# EAGLE design BLE (EAGLE 6.1)
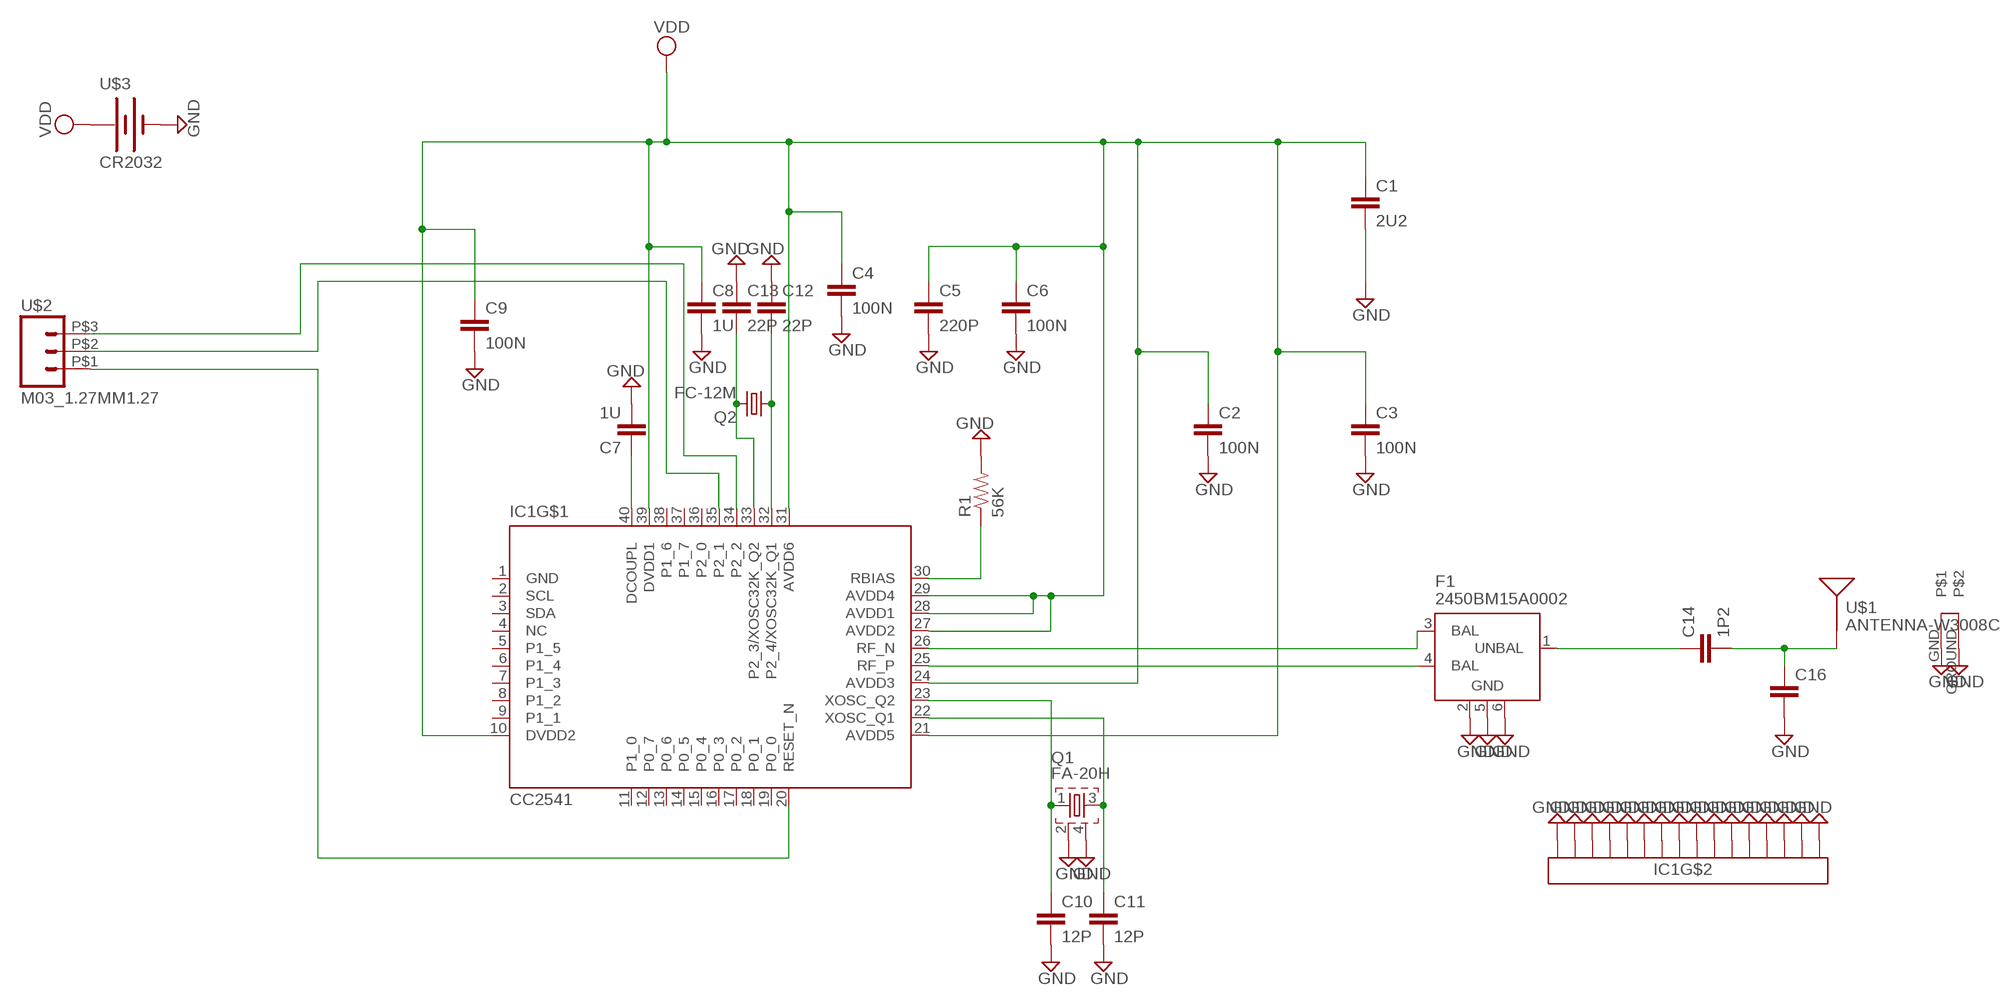
[diagram p0: schematic, sheet 1]

## Parts
C1  2U2  CAP0402-CAP  [0402-CAP]
C2  100N  CAP0402-CAP  [0402-CAP]
C3  100N  CAP0402-CAP  [0402-CAP]
C4  100N  CAP0402-CAP  [0402-CAP]
C5  220P  CAP0402-CAP  [0402-CAP]
C6  100N  CAP0402-CAP  [0402-CAP]
C7  1U  CAP0402-CAP  [0402-CAP]
C8  1U  CAP0402-CAP  [0402-CAP]
C9  100N  CAP0402-CAP  [0402-CAP]
C10  12P  CAP0402-CAP  [0402-CAP]
C11  12P  CAP0402-CAP  [0402-CAP]
C12  22P  CAP0402-CAP  [0402-CAP]
C13  22P  CAP0402-CAP  [0402-CAP]
C14  1P2  CAP0402-CAP  [0402-CAP]
C16  CAP0402-CAP  [0402-CAP]
F1  2450BM15A0002  [2450BM15A0002]
IC1  CC2541  [QFN40-6X6]
Q1  FA-20H  [FA-20H]
Q2  FC-12M  [FC-12M]
R1  56K  RESISTOR0402-RES  [0402-RES]
U$1  ANTENNA-W3008C  [ANTENNA-W3008C]
U$2  M03_1.27MM1.27  [1X3_1.27MM]
U$3  CR2032  [BATTCON_2032]

## Nets
GND: C1.2 C2.2 C3.2 C4.2 C5.2 C6.2 C7.2 C8.2 C9.2 C10.2 C11.2 C12.1 C13.1 C16.2 F1.2(GND) F1.5(GND) F1.6(GND) IC1.EXP@1(EXP16) IC1.EXP@2(EXP16) IC1.EXP@3(EXP16) IC1.EXP@4(EXP16) IC1.EXP@5(EXP16) IC1.EXP@6(EXP16) IC1.EXP@7(EXP16) IC1.EXP@8(EXP16) IC1.EXP@9(EXP16) IC1.EXP@10(EXP16) IC1.EXP@11(EXP16) IC1.EXP@12(EXP16) IC1.EXP@13(EXP16) IC1.EXP@14(EXP16) IC1.EXP@15(EXP16) IC1.EXP@16(EXP16) Q1.2 Q1.4 R1.2 U$1.GND U$1.GROUND U$3.PWR@2(-)
N$1: IC1.30(RBIAS) R1.1
N$2: C7.1 IC1.40(DCOUPL)
N$3: C11.1 IC1.22(XOSC_Q1) Q1.3
N$4: C10.1 IC1.23(XOSC_Q2) Q1.1
N$5: C12.2 IC1.32(P2_4/XOSC32K_Q1) Q2.1
N$6: C13.2 IC1.33(P2_3/XOSC32K_Q2) Q2.2
N$7: F1.3(BAL) IC1.26(RF_N)
N$8: F1.4(BAL) IC1.25(RF_P)
N$9: C14.1 F1.1(UNBAL)
N$10: C14.2 C16.1 U$1.FEED(SIGNAL)
N$11: IC1.20(RESET_N) U$2.P$1
N$13: IC1.34(P2_2) U$2.P$3
N$14: IC1.35(P2_1) U$2.P$2
VDD: C1.1 C2.1 C3.1 C4.1 C5.1 C6.1 C8.1 C9.1 IC1.10(DVDD2) IC1.21(AVDD5) IC1.24(AVDD3) IC1.27(AVDD2) IC1.28(AVDD1) IC1.29(AVDD4) IC1.31(AVDD6) IC1.39(DVDD1) U$3.PWR@1(+)
Unconnected: IC1.2(SCL) IC1.3(SDA) IC1.5(P1_5) IC1.6(P1_4) IC1.7(P1_3) IC1.8(P1_2) IC1.9(P1_1) IC1.11(P1_0) IC1.12(P0_7) IC1.13(P0_6) IC1.14(P0_5) IC1.15(P0_4) IC1.16(P0_3) IC1.17(P0_2) IC1.18(P0_1) IC1.19(P0_0) IC1.36(P2_0) IC1.37(P1_7) IC1.38(P1_6)

## Power pins joined to a net without a drawn wire
GND: IC1.1(GND)
NC: IC1.4(NC)

## Library data of the parts
C1-C14 C16 = SparkFun-Capacitors:CAP: Capacitor Standard 0603 ceramic capacitor, and 0.1" leaded capacitor.
F1 = johanson-technology:2450BM15A0002: 2.45 GHz Impedance Matched Balun-Filter For TI CC253X/CC2540 Chipset family Data sheet <http://www.johansontechnology.com/images/stories/ip/baluns/balun_filter_combo_matched_2450bm15a0002_v8.pdf>
IC1 = texas:CC2541: 2.4-GHz Bluetooth® low energy System-on-Chip Auto generated by make-symbol-device-package-bsdl.ulp Rev. 39 Source: cc2540.txt
Q1 = crystal:FA-: MHz RANGE CRYSTAL UNIT Source: Epson Toyocom
Q2 = crystal:FC-12M: kHz RANGE CRYSTAL UNIT LOW PROFILE SMD Source: Epson Toyocom FC-12M.pdf
R1 = SparkFun-Resistors:RESISTOR: Resistor Basic schematic elements and footprints for 0603, 1206, and PTH resistors.
U$1 = SparkFun-RF:ANTENNA-W3008C
U$2 = SparkFun-Connectors:M03_1.27MM
U$3 = SparkFun-Electromechanical:CR2032

## Board
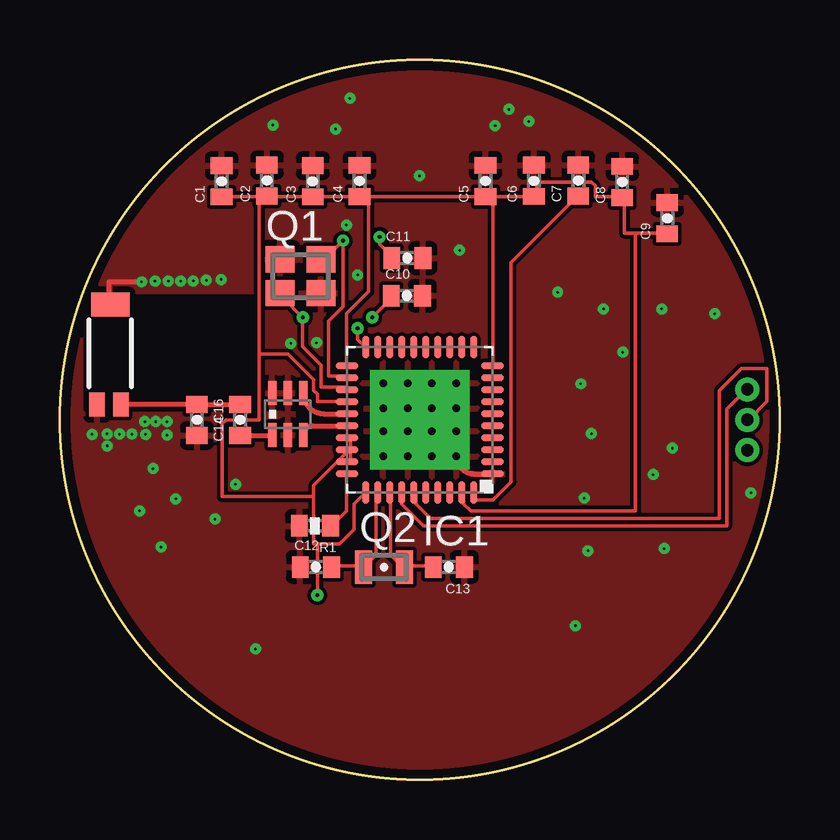
[diagram p1: board, top side]
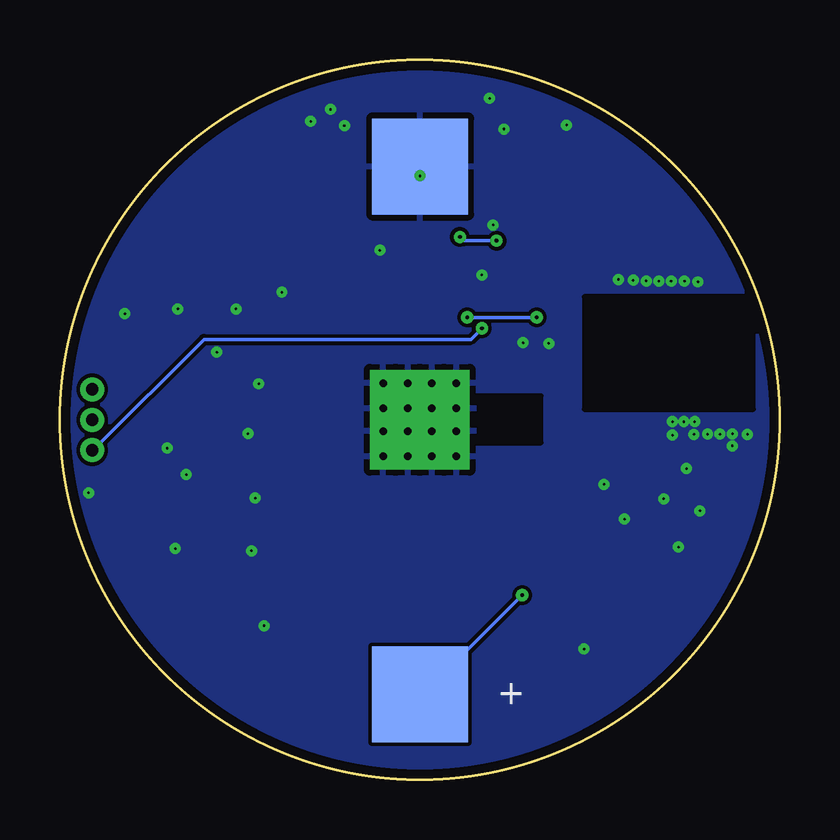
[diagram p2: board, bottom side, seen from below]

Size 30 x 30 mm. Coordinates in mm from the lower left corner, seen from the top.
Outline: circle at 15,15 radius 15
Copper layers (1*16): Top 0.0356mm / dielectric 1.5011mm / Bottom 0.0356mm
Design rules: minimum track width 6mil, minimum drill 13mil, track to track 6mil, track to pad 6mil, pad to pad 6mil, via to via 6mil, smd to smd 6mil, copper to edge 15mil, drill to drill 6mil, minimum pad ring 7mil, minimum via ring 7mil, stop-mask expansion 3mil, vias tented up to drill 0mil, thermal gap 10mil

### Footprints (pad centres in the part's own frame; a part is rotated, then mirrored left to right if it is on the bottom)
0402-CAP = smd 0.7 x 0.9: 1 -0.65,0; 2 0.65,0
2450BM15A0002 = smd 0.35 x 1: 1 -0.65,-0.875; 2 0,-0.875; 3 0.65,-0.875; 4 0.65,0.875; 5 0,0.875; 6 -0.65,0.875
QFN40-6X6 = smd 0.95 x 0.28: 1 -3.025,2.25; 2 -3.025,1.75; 3 -3.025,1.25; 4 -3.025,0.75; 5 -3.025,0.25; 6 -3.025,-0.25; 7 -3.025,-0.75; 8 -3.025,-1.25; 9 -3.025,-1.75; 10 -3.025,-2.25; 21 3.025,-2.25; 22 3.025,-1.75; 23 3.025,-1.25; 24 3.025,-0.75; 25 3.025,-0.25; 26 3.025,0.25; 27 3.025,0.75; 28 3.025,1.25; 29 3.025,1.75; 30 3.025,2.25 | smd 0.28 x 0.95: 11 -2.25,-3.025; 12 -1.75,-3.025; 13 -1.25,-3.025; 14 -0.75,-3.025; 15 -0.25,-3.025; 16 0.25,-3.025; 17 0.75,-3.025; 18 1.25,-3.025; 19 1.75,-3.025; 20 2.25,-3.025; 31 2.25,3.025; 32 1.75,3.025; 33 1.25,3.025; 34 0.75,3.025; 35 0.25,3.025; 36 -0.25,3.025; 37 -0.75,3.025; 38 -1.25,3.025; 39 -1.75,3.025; 40 -2.25,3.025 | drill 0.3 pad 1.1 square: EXP@1 -1.525,1.525; EXP@2 -0.5,1.525; EXP@3 0.5,1.525; EXP@4 1.525,1.525; EXP@5 -1.525,0.475; EXP@6 -0.5,0.475; EXP@7 0.5,0.475; EXP@8 1.525,0.475; EXP@9 -1.525,-0.475; EXP@10 -0.5,-0.475; EXP@11 0.5,-0.475; EXP@12 1.525,-0.475; EXP@13 -1.525,-1.525; EXP@14 -0.5,-1.525; EXP@15 0.5,-1.525; EXP@16 1.525,-1.525
FA-20H = smd 1.2 x 1.1: 1 -0.85,-0.7; 2 0.85,-0.7; 3 0.85,0.7; 4 -0.85,0.7
FC-12M = smd 0.7 x 1.4: 1 -0.85,0; 2 0.85,0
0402-RES = smd 0.7 x 0.9: 1 -0.65,0; 2 0.65,0
ANTENNA-W3008C = smd 0.65 x 1: FEED -0.45,2.52; GROUND 0.55,2.52 | smd 1.6 x 1: GND 0,-1.651
1X3_1.27MM = drill 0.508 pad 1: P$1 -1.27,0; P$2 0,0; P$3 1.27,0
BATTCON_2032 = smd 4 x 4: PWR@1 -11.46,0; PWR@2 10.54,0

### Placement (x,y rotation side)
C1  6.74,24.94 90 top
C2  8.63,24.97 90 top
C3  10.54,24.94 90 top
C4  12.49,24.95 90 top
C5  17.74,24.95 90 top
C6  19.76,24.96 90 top
C7  21.61,24.97 90 top
C8  23.44,24.91 90 top
C9  25.32,23.4 90 top
C10  14.46,20.17 0 top
C11  14.48,21.74 0 top
C12  10.67,8.86 0 top
C13  16.21,8.86 180 top
C14  7.51,14.99 90 top
C16  5.71,14.99 270 top
F1  9.5,15.23 0 top
IC1  15,15 180 top
Q1  10.03,20.98 0 top
Q2  13.51,8.86 0 top
R1  10.63,10.58 180 top
U$1  2.1,18.15 180 top
U$2  28.66,15 90 top
U$3  14.98,15.02 90 bottom

### Tracks (layer width: path | path; a pad name or v marks a point on that pad's centre or on a via)
GND  (via drill 0.1)
  Top 0.203: IC1.EXP@1 arc90 17.25,12.75 IC1.1 | IC1.1 18.19,12.75 IC1.1 | U$1.GND 2.05,19.8 2.05,20.75 v3.4,20.75
  other vias: 3.96,20.78 4.52,20.78 5.03,20.78 5.56,20.79 6.1,20.82 6.72,20.85 9.62,18.18 10.69,18.21 12.41,21.04 11.94,23.12 14.99,25.17 20.75,20.32 23.46,17.82 21.71,16.5 21.86,11.73 22.02,9.54 25.19,9.63 24.73,12.71 4.21,9.69 3.32,11.2 6.46,10.86 7.32,12.31 3.88,12.96 4.83,11.7 1.97,13.91 16.66,22.07 11.49,27.12 8.88,27.29 12.09,28.4 18.72,27.94 19.55,27.44 18.14,27.26 27.3,19.42 22.66,19.62 25.09,19.62 25.53,13.82 22.16,14.42 28.81,11.95 21.49,6.41 8.15,5.44 1.34,14.39 1.96,14.41 2.48,14.4 3,14.4 3.57,14.39 3.54,14.92 3.99,14.92 4.46,14.92 4.46,14.36
  pour Top: 0.27,15.02 arc-180 29.68,15 arc-180
  pour Bottom: 0.27,15.02 arc-180 29.68,15 arc-180
N$1
  Top 0.152: R1.1 11.34,10.58 11.95,11.19 11.95,12.71 IC1.30
N$2
  Top 0.152: C7.1 21.55,24.3 18.81,21.55 18.81,12.41 18.05,11.65 17.29,11.65 17.29,11.95 IC1.40
N$3  (via drill 0.15)
  Top 0.152: v13.32,22.62 13.32,22.32 13.78,21.86 C11.1 | Q1.3 10.88,21.55 v11.8,22.47 11.8,19.72 11.19,19.12 11.19,16.83 11.95,16.83 IC1.22
  Bottom 0.152: v13.32,22.62 13.17,22.47 v11.8,22.47
N$4  (via drill 0.15)
  Top 0.152: v13.02,19.27 13.78,20.03 C10.1 | Q1.1 9.21,20.18 v10.12,19.27 10.12,18.05 10.88,17.29 10.88,16.37 11.95,16.37 IC1.23
  Bottom 0.152: v10.12,19.27 v13.02,19.27
N$5
  Top 0.152: C12.2 11.34,8.9 12.56,8.9 Q2.1 12.71,8.9 13.17,9.36 13.17,11.95 IC1.32
N$6
  Top 0.152: C13.2 15.46,8.9 14.39,8.9 Q2.2 14.24,8.9 13.78,9.36 13.78,11.95 IC1.33
N$7
  Top 0.203: F1.3 arc-90 10.54,14.75 IC1.26
N$8
  Top 0.203: F1.4 arc90 11,15.25 IC1.25
N$9
  Top 0.203: C14.1 F1.1
N$10
  Top 0.203: C16.1 | C16.1 C14.2 | C16.1 | C16.1 U$1.FEED
N$11  (via drill 0.15)
  Top 0.152: v12.41,18.81 12.41,18.35 12.71,18.05 IC1.20
  Bottom 0.152: v12.41,18.81 12.87,18.35 23.99,18.35 28.56,13.78 U$2.P$1
N$12
  pour Top: 8.17,15.28 0.25,15.28 0.25,15.25
N$13
  Top 0.152: IC1.34 14.24,11.95 14.24,11.5 15.15,10.58 27.8,10.58 27.8,15.46 28.56,16.22 U$2.P$3
N$14
  Top 0.152: IC1.35 14.85,11.95 14.85,11.5 15.46,10.88 27.5,10.88 27.5,16.22 28.41,17.13 29.48,17.13 29.48,15.76 28.72,15 U$2.P$2
N$15
  cutout Bottom (isolate 1.27): 1.21,20.13 8.14,20.13 8.14,15.43 1.09,15.43 1.09,20.11 1.21,20.11
  cutout Top (isolate 1.27): 1.21,20.13 8.14,20.13 8.14,15.43 1.09,15.43 1.09,20.11 1.21,20.11
N$16
  cutout Top (isolate 1.27): 9.96,16 12.54,16 12.54,14.04 9.94,14.04 9.94,16
  cutout Bottom (isolate 1.27): 9.96,16 12.54,16 12.54,14.04 9.94,14.04 9.94,16
VDD  (via drill 0.15)
  Top 0.152: 23.99,22.77 23.53,22.77 23.53,24.14 C8.1 23.38,24.3 22.32,24.3 22.32,24.75 22.16,24.91 19.88,24.91 19.88,24.45 C6.1 19.72,24.3 18.05,24.3 | 23.99,22.77 25.21,22.77 C9.1 | 23.99,22.77 23.99,11.19 17.13,11.19 16.83,11.5 16.83,11.95 IC1.39 | 18.05,24.3 C5.1 | 18.05,24.3 18.05,17.29 IC1.10 | 18.05,24.3 C5.1 | IC1.29 12.1,13.32 12.1,13.63 IC1.28 | IC1.27 12.1,14.24 12.1,13.78 IC1.28 | 10.73,9.82 10.58,9.82 10.58,11.8 | 10.73,9.82 11.65,9.82 12.26,10.43 12.26,11.5 12.71,11.95 IC1.31 | 10.58,11.8 10.58,12.26 11.95,13.63 IC1.28 | 8.29,24.3 8.6,24.3 C2.1 | 8.29,24.3 6.77,24.3 C1.1 | C2.1 8.75,24.3 10.43,24.3 C3.1 10.58,24.3 12.41,24.3 C4.1 | 8.29,17.74 9.51,17.74 10.58,16.68 10.58,16.22 10.73,16.07 10.73,15.76 11.95,15.76 IC1.24 | 8.29,24.3 8.29,17.74 | 8.29,24.3 C2.1 | 12.56,24.3 12.87,23.99 12.87,20.33 11.95,19.42 11.95,17.29 IC1.21 | 12.56,24.3 C4.1 | 10.58,11.8 6.77,11.8 6.77,14.85 6.92,15 8.29,15 8.29,17.74 | 12.56,24.3 17.59,24.3 C5.1 | 12.56,24.3 C4.1 | 10.73,9.82 v10.73,7.68
  Bottom 0.152: v10.73,7.68 14.85,3.57 U$3.PWR@1